# Altium schematic sheet EthTransformers.SchDoc
size A4
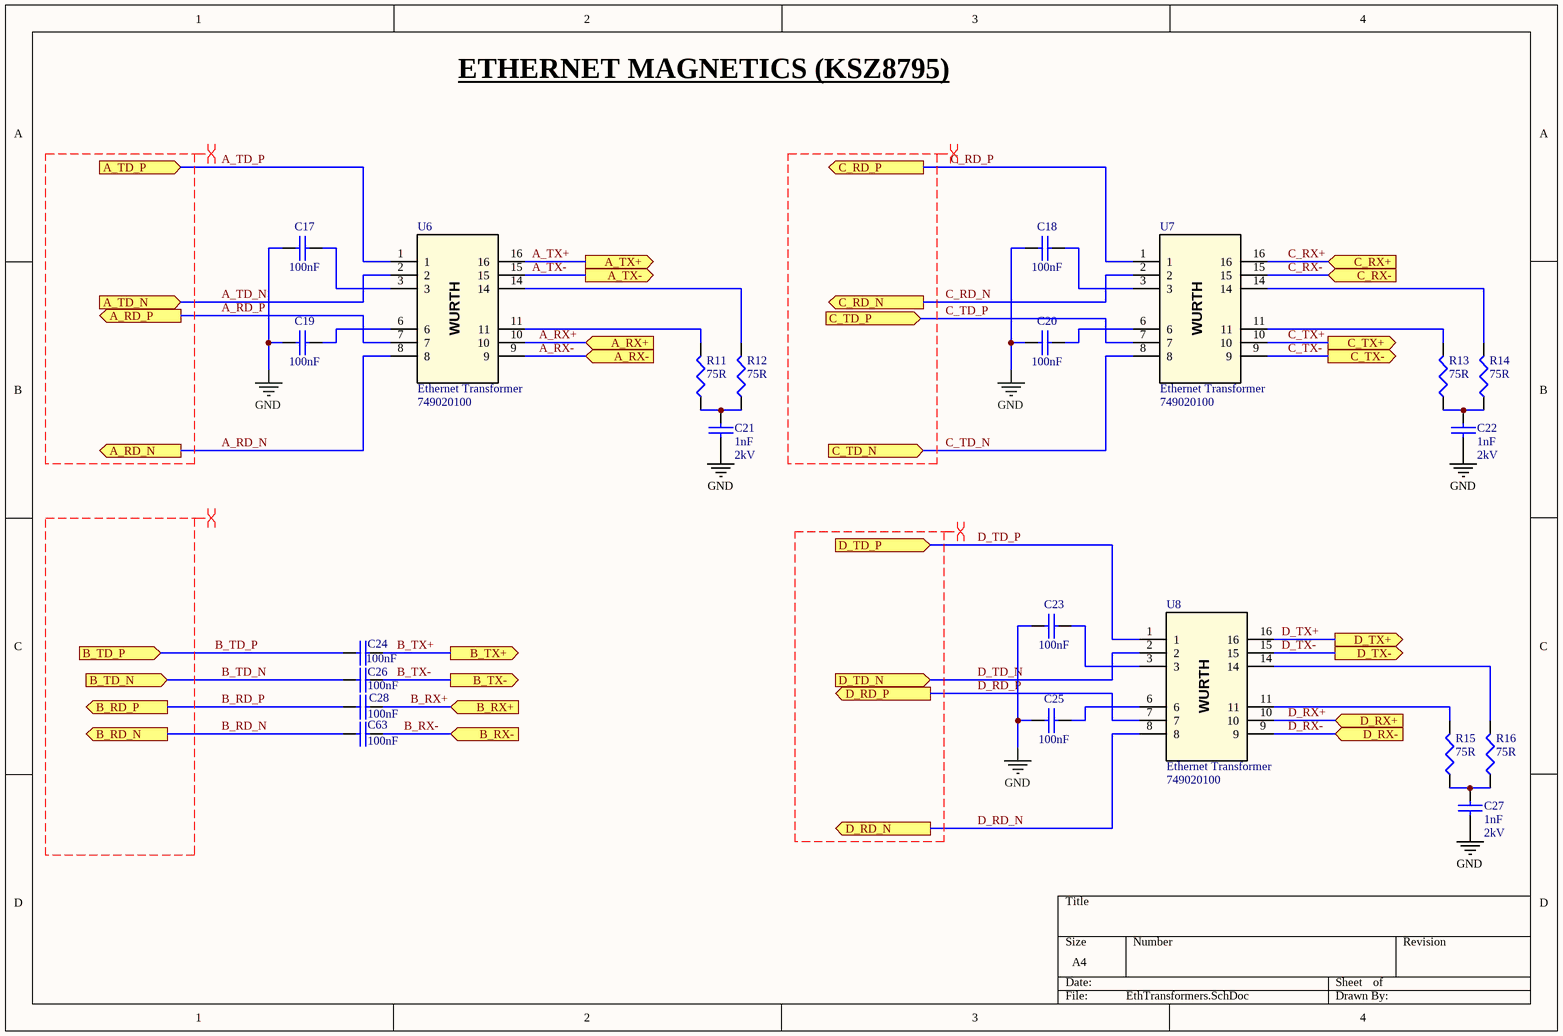
[diagram p0: EthTransformers.SchDoc]

## Parts
C17  Capacitance: 100nF  [CAP0402]  (hidden comment: Capacitor)
C18  Capacitance: 100nF  [CAP0402]  (hidden comment: Capacitor)
C19  Capacitance: 100nF  [CAP0402]  (hidden comment: Capacitor)
C20  Capacitance: 100nF  [CAP0402]  (hidden comment: Capacitor)
C21  Capacitance: 1nF  Voltage Rating (DC): 2kV  [CAP1206]  (hidden comment: Capacitor)
C22  Capacitance: 1nF  Voltage Rating (DC): 2kV  [CAP1206]  (hidden comment: Capacitor)
C23  Capacitance: 100nF  [CAP0402]  (hidden comment: Capacitor)
C24  Capacitance: 100nF  [CAP0402]  (hidden comment: Capacitor)
C25  Capacitance: 100nF  [CAP0402]  (hidden comment: Capacitor)
C26  Capacitance: 100nF  [CAP0402]  (hidden comment: Capacitor)
C27  Capacitance: 1nF  Voltage Rating (DC): 2kV  [CAP1206]  (hidden comment: Capacitor)
C28  Capacitance: 100nF  [CAP0402]  (hidden comment: Capacitor)
C63  Capacitance: 100nF  [CAP0402]  (hidden comment: Capacitor)
R11  Resistance: 75R  [RES0402]  (hidden comment: Res)
R12  Resistance: 75R  [RES0402]  (hidden comment: Res)
R13  Resistance: 75R  [RES0402]  (hidden comment: Res)
R14  Resistance: 75R  [RES0402]  (hidden comment: Res)
R15  Resistance: 75R  [RES0402]  (hidden comment: Res)
R16  Resistance: 75R  [RES0402]  (hidden comment: Res)
U6  Ethernet Transformer  [749020100]
U7  Ethernet Transformer  [749020100]
U8  Ethernet Transformer  [749020100]

## Ports
A_RD_N (out), A_RD_P (out), A_RX+ (in), A_RX- (in), A_TD_N (in), A_TD_P (in), A_TX+ (out), A_TX- (out), B_RD_N (out), B_RD_P (out), B_RX+ (in), B_RX- (in), B_TD_N (in), B_TD_P (in), B_TX+ (out), B_TX- (out), C_RD_N (out), C_RD_P (out), C_RX+ (in), C_RX- (in), C_TD_N (in), C_TD_P (in), C_TX+ (out), C_TX- (out), D_RD_N (out), D_RD_P (out), D_RX+ (in), D_RX- (in), D_TD_N (in), D_TD_P (in), D_TX+ (out), D_TX- (out)

## Nets
GND: C17.2 C18.2 C19.2 C20.2 C21.2 C22.2 C23.2 C25.2 C27.2
A_RD_N: U6.8 ; port A_RD_N
A_RD_P: U6.7 ; port A_RD_P
A_RX+: U6.10 ; port A_RX+
A_RX-: U6.9 ; port A_RX-
A_TD_N: U6.2 ; port A_TD_N
A_TD_P: U6.1 ; port A_TD_P
A_TX+: U6.16 ; port A_TX+
A_TX-: U6.15 ; port A_TX-
B_RD_N: C63.2 ; port B_RD_N
B_RD_P: C28.2 ; port B_RD_P
B_RX+: C28.1 ; port B_RX+
B_RX-: C63.1 ; port B_RX-
B_TD_N: C26.2 ; port B_TD_N
B_TD_P: C24.2 ; port B_TD_P
B_TX+: C24.1 ; port B_TX+
B_TX-: C26.1 ; port B_TX-
C_RD_N: U7.2 ; port C_RD_N
C_RD_P: U7.1 ; port C_RD_P
C_RX+: U7.16 ; port C_RX+
C_RX-: U7.15 ; port C_RX-
C_TD_N: U7.8 ; port C_TD_N
C_TD_P: U7.7 ; port C_TD_P
C_TX+: U7.10 ; port C_TX+
C_TX-: U7.9 ; port C_TX-
D_RD_N: U8.8 ; port D_RD_N
D_RD_P: U8.7 ; port D_RD_P
D_RX+: U8.10 ; port D_RX+
D_RX-: U8.9 ; port D_RX-
D_TD_N: U8.2 ; port D_TD_N
D_TD_P: U8.1 ; port D_TD_P
D_TX+: U8.16 ; port D_TX+
D_TX-: U8.15 ; port D_TX-
NetC17_1: C17.1 U6.3
NetC18_1: C18.1 U7.3
NetC19_1: C19.1 U6.6
NetC20_1: C20.1 U7.6
NetC21_1: C21.1 R11.1 R12.1
NetC22_1: C22.1 R13.1 R14.1
NetC23_1: C23.1 U8.3
NetC25_1: C25.1 U8.6
NetC27_1: C27.1 R15.1 R16.1
NetR11_2: R11.2 U6.11
NetR12_2: R12.2 U6.14
NetR13_2: R13.2 U7.11
NetR14_2: R14.2 U7.14
NetR15_2: R15.2 U8.11
NetR16_2: R16.2 U8.14

## Layout directives
differential pair; differential pair class DIFF_A; rule Differential Pairs Routing [Pref Gap = 0.2mm    Min Gap  = 0.15mm    Max Gap  = 0.25mmPref Width = 0.2mm    Min Width  = 0.15mm    Max Width  = 0.2mm]: (no net found under the mark)
differential pair; rule Differential Pairs Routing [Pref Gap = 0.2mm    Min Gap  = 0.15mm    Max Gap  = 0.25mmPref Width = 0.2mm    Min Width  = 0.15mm    Max Width  = 0.2mm]; differential pair class DIFF_B: (no net found under the mark)
differential pair; differential pair class DIFF_C; rule Differential Pairs Routing [Pref Gap = 0.2mm    Min Gap  = 0.15mm    Max Gap  = 0.25mmPref Width = 0.2mm    Min Width  = 0.15mm    Max Width  = 0.2mm]: (no net found under the mark)
differential pair; differential pair class DIFF_D; rule Differential Pairs Routing [Pref Gap = 0.2mm    Min Gap  = 0.15mm    Max Gap  = 0.25mmPref Width = 0.2mm    Min Width  = 0.15mm    Max Width  = 0.2mm]: (no net found under the mark)

## Notes on the sheet
- ETHERNET MAGNETICS (KSZ8795)
- (in symbol 749020100) WURTH

## Library data of the parts
C17-C20 C23-C26 C28 C63 = Capacitor: Manufacturer: TDK; Manufacturer Part Number: CGA2B3X7R1H104K050BB; Voltage Rating: 50V; Tolerance: 10%; Dielectric: X7R; Supplier 1: Digi-Key; Supplier Part Number 1: 445-6899-1-ND; Stock 1: 14098587; Mount: Surface Mount; Case/Package: 0402; Weight: 2.3E-05oz; Case Code (Metric): 1005; Case Code (Imperial): 0402; Min Operating Temperature: -55°C; Max Operating Temperature: 125°C; Packaging: Tape and Reel; Package Quantity: 1; Voltage Rating (DC): 50V; Termination: SMD/SMT; Composition: Ceramic; Voltage: 50V; Length: 1mm; Height: 0.5mm; Width: 0.02inch; Thickness: 0.022inch; Depth: 0.5mm; Ratings: AEC-Q200; REACH SVHC: No SVHC; Lead Free: Lead Free; ComponentLink1URL: http://product.tdk.com/capacitor/mlcc/en/documents/mlccspec_automotive_general_midvoltage_en.pdf?src-supplier=Future+Electronics; ComponentLink1Description: http://product.tdk.com/capacitor/mlcc/en/documents/mlccspec_automotive_general_midvoltage_en.pdf?src-supplier=Future+Electronics; ComponentLink2URL: http://www.farnell.com/datasheets/1807242.pdf?src-supplier=Element14; ComponentLink2Description: http://www.farnell.com/datasheets/1807242.pdf?src-supplier=Element14; ComponentLink3URL: http://www.mouser.com/ds/2/400/lcc_automotive_general_en-843974.pdf?src-supplier=Mouser; ComponentLink3Description: http://www.mouser.com/ds/2/400/lcc_automotive_general_en-843974.pdf?src-supplier=Mouser; ComponentLink4URL: http://www.farnell.com/datasheets/1936565.pdf?src-supplier=Element14; ComponentLink4Description: http://www.farnell.com/datasheets/1936565.pdf?src-supplier=Element14; ComponentLink5URL: http://www.farnell.com/datasheets/1735392.pdf?src-supplier=Element14; ComponentLink5Description: http://www.farnell.com/datasheets/1735392.pdf?src-supplier=Element14
C21 C22 C27 = Capacitor: Dielectric Material: Ceramic; Dielectric: X7R; Manufacturer: *; Manufacturer Part Number: *; Supplier: *; Supplier Part Number: *; Tolerance: *; Voltage: *; Footprint: *; Temperature Coefficient: *; Supplier 1: Digi-Key; Supplier Part Number 1: 399-4819-1-ND; Stock 1: 192377; Mount: Surface Mount; Case/Package: 1206; Min Operating Temperature: -55°C; Max Operating Temperature: 125°C; Packaging: Tape and Reel; Length: 3.2mm; Height: 1.6mm; Depth: 1.6mm; Radiation Hardening: No; ComponentLink1URL: http://www.farnell.com/datasheets/1807957.pdf?src-supplier=Element14; ComponentLink1Description: http://www.farnell.com/datasheets/1807957.pdf?src-supplier=Element14; ComponentLink2URL: https://www.verical.com/server-webapp/html/getDatasheet?partID=359031&src-supplier=Verical; ComponentLink2Description: https://www.verical.com/server-webapp/html/getDatasheet?partID=359031&src-supplier=Verical; ComponentLink3URL: http://www.farnell.com/datasheets/1372242.pdf?src-supplier=Element14; ComponentLink3Description: http://www.farnell.com/datasheets/1372242.pdf?src-supplier=Element14
R11-R16 = Resistor: Manufacturer: Yageo; Manufacturer Part Number: RC0402FR-0775RL; Tolerance: 1%; Voltage Rating (DC): 50V; Power Rating: 62.5mW; Temperature Coefficient: 100ppm/°C; Max Power Dissipation: 63mW; Supplier 1: Digi-Key; Supplier Part Number 1: 311-75.0LRCT-ND; Stock 1: 2542126; Case/Package: 0402; Case Code (Metric): 1005; Case Code (Imperial): 0402; Min Operating Temperature: -55°C; Max Operating Temperature: 155°C; Packaging: Tape and Reel; Package Quantity: 10000; Features: Moisture Resistant; Voltage Rating: 50V; Composition: Thick Film; Number of Terminations: 2; Termination: SMD/SMT; Military Standard: Not; Working Voltage: 50V; Length: 1mm; Height: 0.016inch; Width: 0.02inch; Depth: 0.5mm; Lead Free: Lead Free; REACH SVHC: No SVHC; ComponentLink1URL: http://www.farnell.com/datasheets/1018594.pdf?src-supplier=Element14; ComponentLink1Description: http://www.farnell.com/datasheets/1018594.pdf?src-supplier=Element14; ComponentLink2URL: https://www.verical.com/server-webapp/html/getDatasheet?partID=326375&src-supplier=Verical; ComponentLink2Description: https://www.verical.com/server-webapp/html/getDatasheet?partID=326375&src-supplier=Verical; ComponentLink3URL: http://www.yageo.com/documents/recent/PYu-RC_Group_51_RoHS_L_10.pdf?src-supplier=Digi-Key; ComponentLink3Description: http://www.yageo.com/documents/recent/PYu-RC_Group_51_RoHS_L_10.pdf?src-supplier=Digi-Key; ComponentLink4URL: http://www.farnell.com/datasheets/2167052.pdf?src-supplier=Element14; ComponentLink4Description: http://www.farnell.com/datasheets/2167052.pdf?src-supplier=Element14
U6-U8 = 749020100: 350µH LAN 10/100/1000 Base-T Pulse Transformer 1:1 Surface Mount; Manufacturer 1: Wurth Electronics; Inductance: 350uH; Supplier 1: Digi-Key; Stock 1: 1037; Pricing 1: 1=6,48000, 25=5,60800, 100=4,94900, 250=4,61900, 500=4,12402 (USD); RoHS: Yes; Mount: Surface Mount; Package Quantity: 1; Length: 12.83mm; Height - Seated (Max): 2.16mm; Width: 6.7mm; REACH SVHC: Unknown; ComponentLink1URL: https://datasheet.ciiva.com/1378/1736628-1378085.pdf?src-supplier=Element14; ComponentLink1Description: https://datasheet.ciiva.com/1378/1736628-1378085.pdf?src-supplier=Element14; ComponentLink2URL: https://datasheet.ciiva.com/2938/749020100-2938743.pdf?src-supplier=Digi-Key; ComponentLink2Description: https://datasheet.ciiva.com/2938/749020100-2938743.pdf?src-supplier=Digi-Key; ComponentLink3URL: https://datasheet.ciiva.com/2938/749020100-2938744.pdf?src-supplier=Digi-Key; ComponentLink3Description: https://datasheet.ciiva.com/2938/749020100-2938744.pdf?src-supplier=Digi-Key; ComponentLink4URL: https://datasheet.ciiva.com/2938/749020100-2938745.pdf?src-supplier=Digi-Key; ComponentLink4Description: https://datasheet.ciiva.com/2938/749020100-2938745.pdf?src-supplier=Digi-Key; Supplier Part Number 1: 732-3268-1-ND; Manufacturer Part Number 1: 749020100